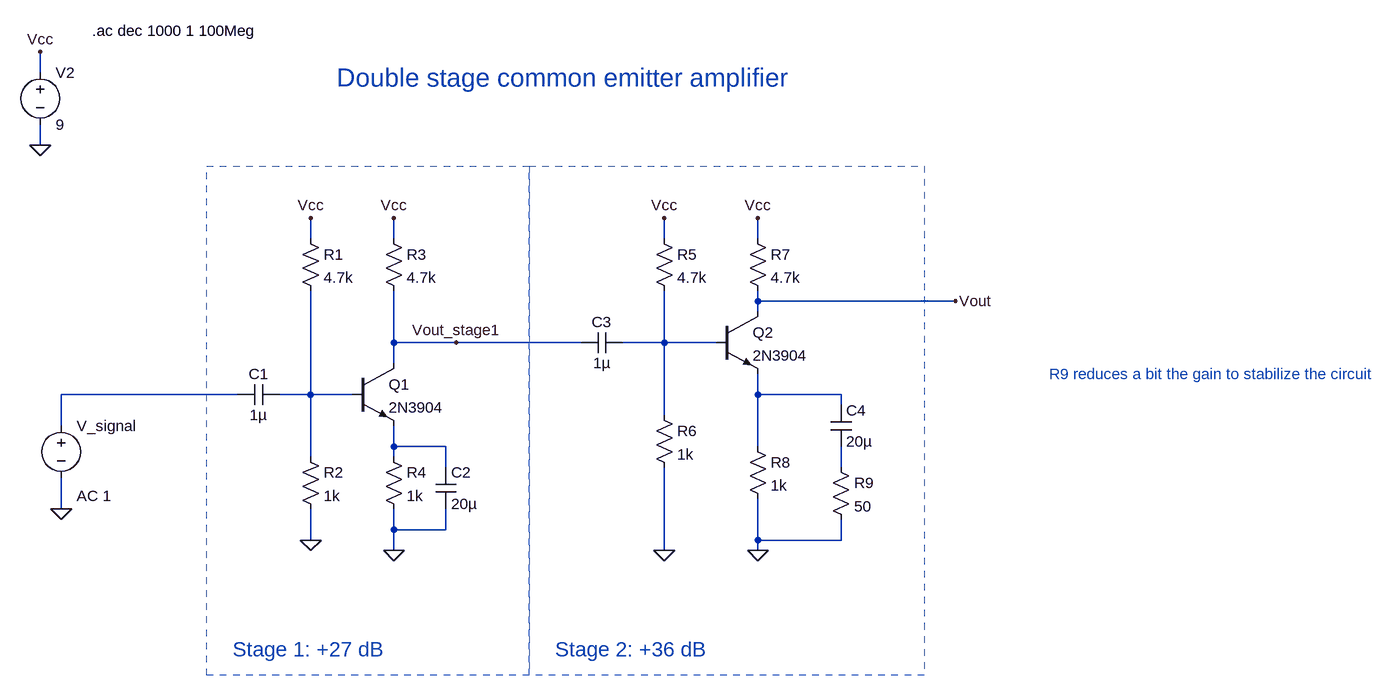
[diagram p0: schematic Double-stage-common-emitter-amplifier.asc]
Double-stage-common-emitter-amplifier.asc, the LTspice schematic file:
Version 4
SHEET 1 1716 680
WIRE -368 -384 -368 -416
WIRE -368 -272 -368 -304
WIRE 48 -128 48 -160
WIRE 176 -128 176 -160
WIRE 592 -128 592 -160
WIRE 736 -128 736 -160
WIRE 736 -32 736 -48
WIRE 1040 -32 736 -32
WIRE 736 -16 736 -32
WIRE 176 32 176 -48
WIRE 272 32 176 32
WIRE 464 32 272 32
WIRE 592 32 592 -48
WIRE 592 32 528 32
WIRE 672 32 592 32
WIRE 176 64 176 32
WIRE -64 112 -336 112
WIRE 48 112 48 -48
WIRE 48 112 0 112
WIRE 112 112 48 112
WIRE 736 112 736 80
WIRE 864 112 736 112
WIRE 864 128 864 112
WIRE 592 144 592 32
WIRE -336 160 -336 112
WIRE 176 192 176 160
WIRE 256 192 176 192
WIRE 736 192 736 112
WIRE 48 208 48 112
WIRE 176 208 176 192
WIRE 256 224 256 192
WIRE 864 224 864 192
WIRE -336 288 -336 240
WIRE 176 320 176 288
WIRE 256 320 256 288
WIRE 256 320 176 320
WIRE 48 336 48 288
WIRE 736 336 736 272
WIRE 864 336 864 304
WIRE 864 336 736 336
WIRE 176 352 176 320
WIRE 592 352 592 224
WIRE 736 352 736 336
FLAG 48 336 0
FLAG -336 288 0
FLAG -368 -272 0
FLAG -368 -416 Vcc
FLAG 176 352 0
FLAG 592 352 0
FLAG 736 352 0
FLAG 48 -160 Vcc
FLAG 176 -160 Vcc
FLAG 592 -160 Vcc
FLAG 736 -160 Vcc
FLAG 1040 -32 Vout
FLAG 272 32 Vout_stage1
SYMBOL cap 0 96 R90
WINDOW 0 0 32 VBottom 2
WINDOW 3 32 32 VTop 2
SYMATTR InstName C1
SYMATTR Value 1µ
SYMBOL res 32 -144 R0
SYMATTR InstName R1
SYMATTR Value 4.7k
SYMBOL res 32 192 R0
SYMATTR InstName R2
SYMATTR Value 1k
SYMBOL res 160 -144 R0
SYMATTR InstName R3
SYMATTR Value 4.7k
SYMBOL res 160 192 R0
SYMATTR InstName R4
SYMATTR Value 1k
SYMBOL cap 240 224 R0
SYMATTR InstName C2
SYMATTR Value 20µ
SYMBOL npn 112 64 R0
SYMATTR InstName Q1
SYMATTR Value 2N3904
SYMBOL voltage -336 144 R0
WINDOW 123 24 124 Left 2
WINDOW 39 0 0 Left 0
SYMATTR Value2 AC 1
SYMATTR InstName V_signal
SYMATTR Value ""
SYMBOL voltage -368 -400 R0
WINDOW 123 0 0 Left 0
WINDOW 39 0 0 Left 0
SYMATTR InstName V2
SYMATTR Value 9
SYMBOL cap 528 16 R90
WINDOW 0 0 32 VBottom 2
WINDOW 3 32 32 VTop 2
SYMATTR InstName C3
SYMATTR Value 1µ
SYMBOL res 576 -144 R0
SYMATTR InstName R5
SYMATTR Value 4.7k
SYMBOL res 576 128 R0
SYMATTR InstName R6
SYMATTR Value 1k
SYMBOL res 720 -144 R0
SYMATTR InstName R7
SYMATTR Value 4.7k
SYMBOL npn 672 -16 R0
SYMATTR InstName Q2
SYMATTR Value 2N3904
SYMBOL res 720 176 R0
SYMATTR InstName R8
SYMATTR Value 1k
SYMBOL res 848 208 R0
SYMATTR InstName R9
SYMATTR Value 50
SYMBOL cap 848 128 R0
SYMATTR InstName C4
SYMATTR Value 20µ
TEXT -288 -448 Left 2 !.ac dec 1000 1 100Meg
TEXT -72 504 Left 3 ;Stage 1: +27 dB
TEXT 424 504 Left 3 ;Stage 2: +36 dB
TEXT 1184 80 Left 2 ;R9 reduces a bit the gain to stabilize the circuit
TEXT 88 -376 Left 4 ;Double stage common emitter amplifier
RECTANGLE Normal 384 544 -112 -240 2
RECTANGLE Normal 992 544 384 -240 2

The netlist it stands for:
* Double-stage-common-emitter-amplifier.asc
C1 N003 N002 1µ
R1 Vcc N003 4.7k
R2 N003 0 1k
R3 Vcc Vout_stage1 4.7k
R4 N005 0 1k
C2 N005 0 20µ
Q1 Vout_stage1 N003 N005 0 2N3904
V_signal N002 0 AC 1
V2 Vcc 0 9
C3 N001 Vout_stage1 1µ
R5 Vcc N001 4.7k
R6 N001 0 1k
R7 Vcc Vout 4.7k
Q2 Vout N001 N004 0 2N3904
R8 N004 0 1k
R9 N006 0 50
C4 N004 N006 20µ
.model NPN NPN
.model PNP PNP
.lib standard.bjt
.ac dec 1000 1 100Meg
* Stage 1: +27 dB
* Stage 2: +36 dB
* R9 reduces a bit the gain to stabilize the circuit
* Double stage common emitter amplifier
.backanno
.end